# Altium schematic sheet OutProtect.SchDoc
size A4; Organization: Altium Limited; Address1: L3, 12a Rodborough Rd; Address2: Frenchs Forest; Address3: NSW; Address4: Australia 2086
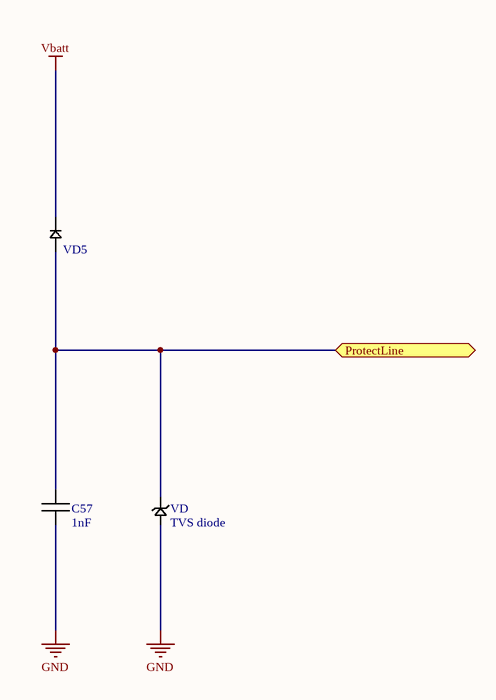
[diagram p0: OutProtect.SchDoc]

## Parts
C57  1nF  [SMD 0603]
VD  TVS diode  [SOD323]
VD5  Diode  [SOD323]  (value not drawn)

## Ports
ProtectLine (bidir)

## Nets
GND: C57.1 VD.2
Vbatt: VD5.1
ProtectLine: C57.2 VD.1 VD5.0 ; port ProtectLine

## Notes on the sheet
- Title
- Size:
- Date:
- A4
- Number:
- Time:
- Revision:
- Sheet
- of
- File:

## Library data of the parts
C57 = Capasitor: CC0603KRX7R9BB102; Value: 1nF
VD = TVS diode: CDSOD323-T18LC
VD5 = Diode: PMEG2020EJ.115; pin to pad: 0>2